# Altium schematic sheet HLib-Comm-CAN.SchDoc
size A
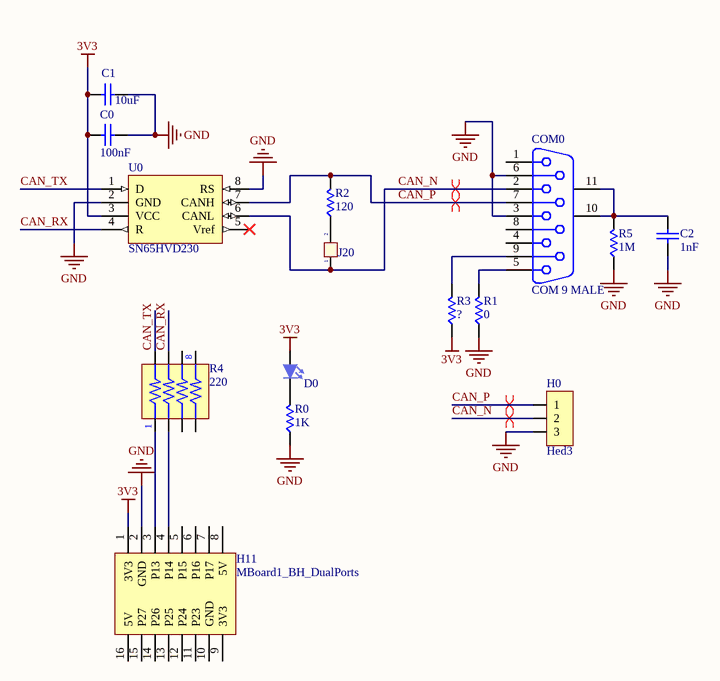
[diagram p0: HLib-Comm-CAN.SchDoc]

## Parts
C0  value 100nF  [SM_0805_C_CERAMIC]  (hidden comment: C_Ceramic)
C1  value 10uF  [SM_0805_C_CERAMIC]  (hidden comment: C_Ceramic)
C2  value 1nF  [SM_0805_C_CERAMIC]  (hidden comment: C_Ceramic)
COM0  COM 9 MALE  [DSB 9-M]
D0  LED  [SM_0805_LED]  (value not drawn)
H0  Hed3  [Hed3]
H11  MBoard1_BH_DualPorts  [MBoard1_BH_DualPorts]
J20  Jumper 2  [HD_MALE_2_100mil_straight]  (value not drawn)
R0  value 1K  [SM_0805_R]  (hidden comment: R)
R1  value 0  [SM_0805_R]  (hidden comment: R)
R2  value 120  [SM_0805_R]  (hidden comment: R)
R3  R  [SM_0805_R]  (value not drawn)
R4  220  [RA4]
R5  value 1M  [SM_0805_R]  (hidden comment: R)
U0  SN65HVD230  [SO-8]

## Nets
3V3: C0.1 C1.1 D0.1(A) H11.1(3V3) R3.1 U0.3(VCC)
GND: C0.2 C1.2 C2.1 COM0.3 COM0.6 H0.3 H11.2(GND) R0.1 R1.1 R5.1 U0.2(GND) U0.8(RS)
CAN_N: COM0.2 H0.2 J20.1 U0.6(CANL)
CAN_P: COM0.7 H0.1 R2.2 U0.7(CANH)
CAN_RX: R4.4 U0.4(R)
CAN_TX: R4.2 U0.1(D)
NetC2_2: C2.2 COM0.10(MH1) COM0.11(MH2) R5.2
NetCOM0_5: COM0.5 R1.2
NetCOM0_9: COM0.9 R3.2
NetD0_2: D0.2(K) R0.2
NetH11_3: H11.3(P13) R4.1
NetH11_4: H11.4(P14) R4.3
NetJ20_2: J20.2 R2.1

Not connected (* = marked no-connect by the designer): COM0 1 4 8; H11 5(P15) 6(P16) 7(P17) 8(5V) 9(3V3) 10(GND) 11(P23) 12(P24) 13(P25) 14(P26) 15(P27) 16(5V); R4 5 6 7 8; U0 5(Vref)*

## Layout directives
differential pair: CAN_N, CAN_P

## Library data of the parts
C0-C2 = C_Ceramic: Non-polarity ceramic capacitor; Published: 8-Jun-2000; LatestRevisionDate: 17-Jul-2002; LatestRevisionNote: Re-released for DXP Platform.; PackageReference: RAD-0.3; Publisher: Altium Limited; PackageDescription: Radial Cap, Thru-Hole; 2 Leads; 0.3 in Pin Spacing
COM0 = DSB9F: COM 9; PackageDocument: O; Positions: 9; Gender: Receptacle; Value: COM 9; Published: 15-Jun-2001; LatestRevisionDate: 17-Jul-2002; LatestRevisionNote: Re-released for DXP Platform.; DatasheetDocument: 1-Sep-1999; PackageReference: 788750; Publisher: Altium Limited; Orientation: Right Angle
J20 = JP 2: Value: JP 2
R0-R3 R5 = R: Resistor; Published: 8-Jun-2000; LatestRevisionDate: 29-May-2009; LatestRevisionNote: IPC-7351 Footprint Added.; PackageReference: J1-0603; Publisher: Altium Limited; PackageDescription: Chip Resistor
  R3: Value: ?
R4 = RA4
D0 = LED: Published: 8-Jun-2000; LatestRevisionDate: 08-Jul-2005; LatestRevisionNote: Mech Layer 1 removed.; PackageReference: LED-1; Publisher: Altium Limited; PackageDescription: LED; 2 Leads